# EAGLE design I2C (EAGLE 6.2)
I2C for PI GPIO Port (Pi4IoT)
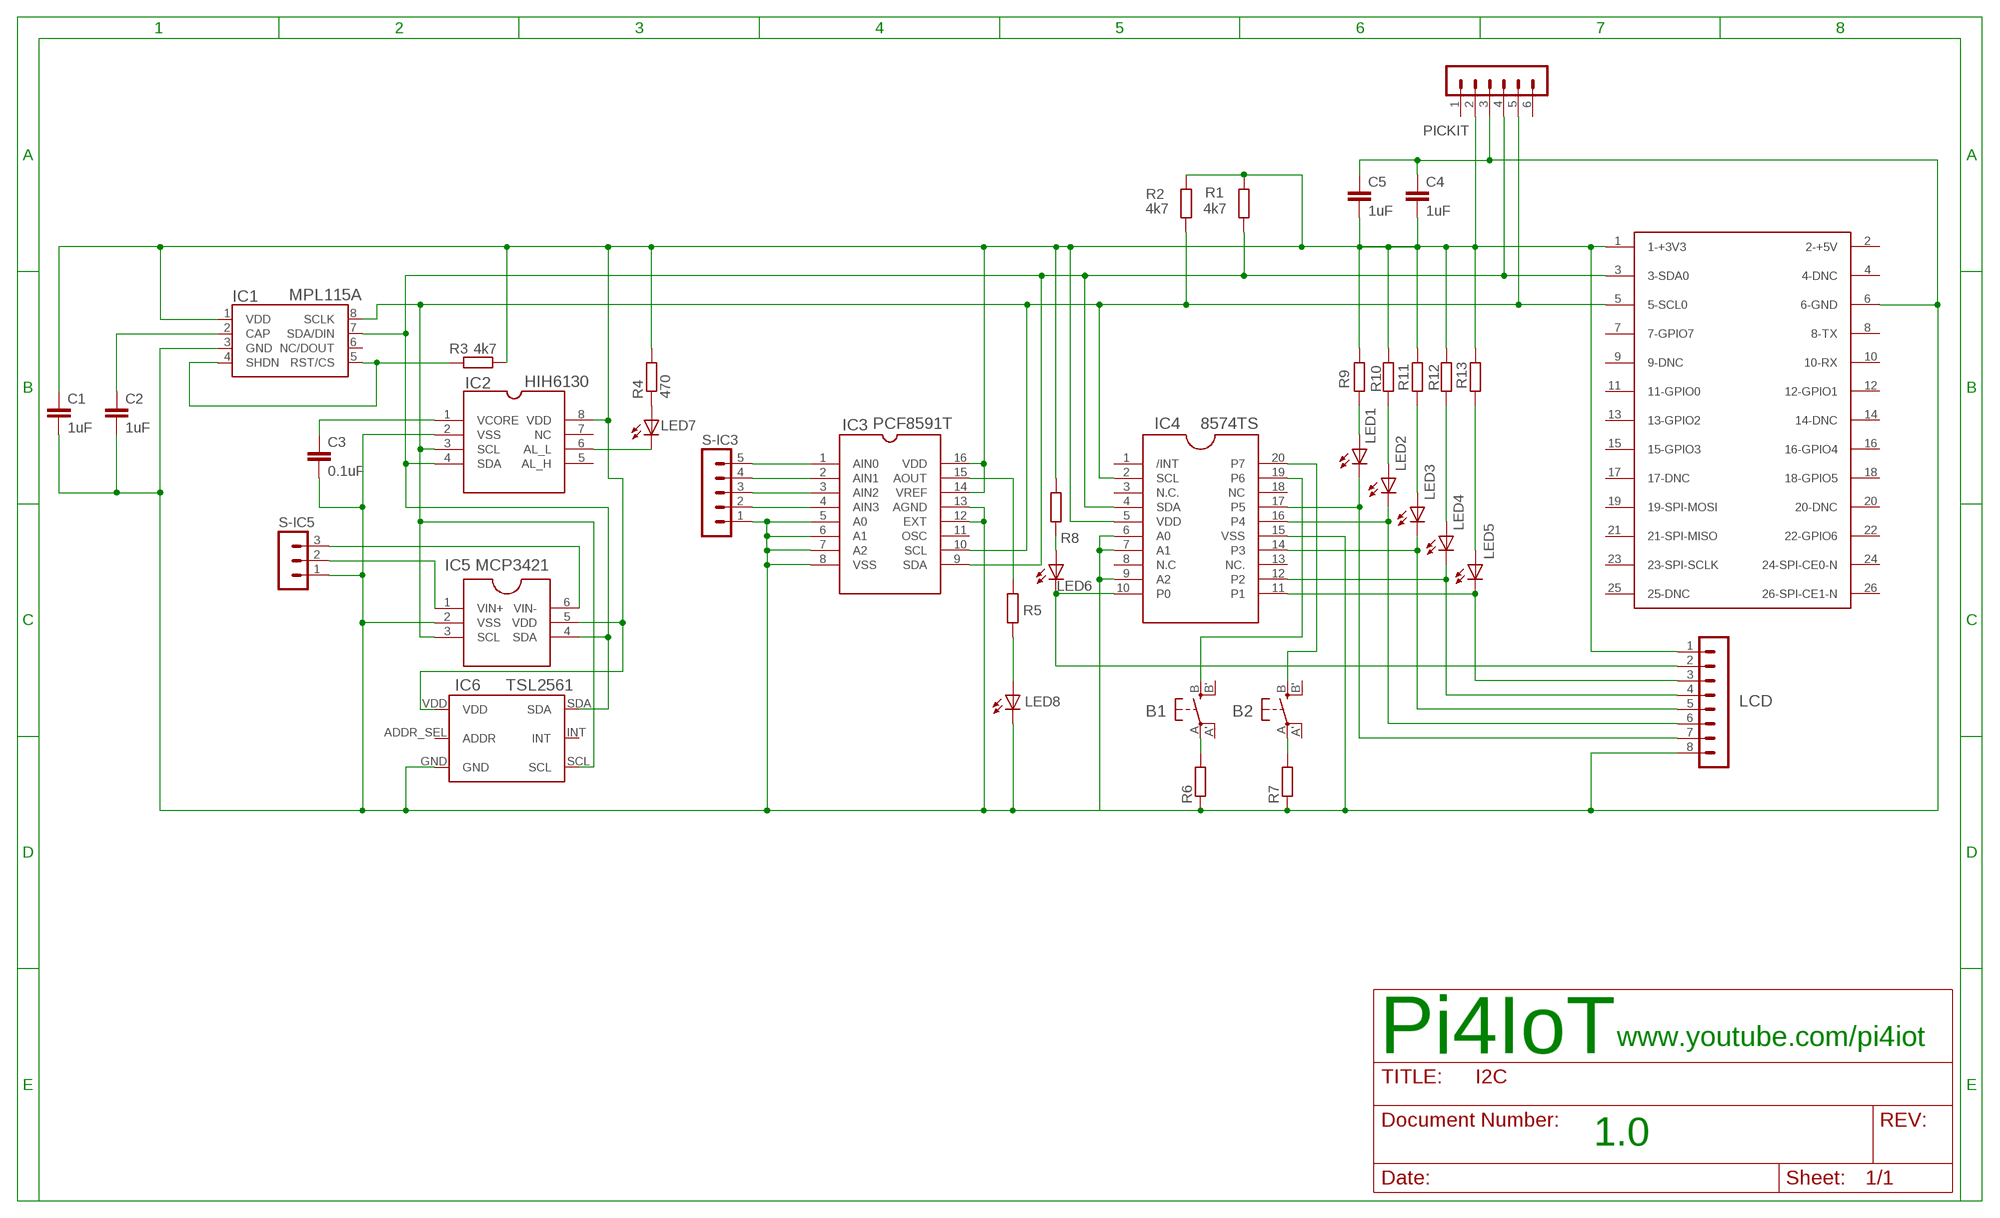
[diagram p0: schematic, sheet 1]

## Parts
B1  SWITCH_TACT_SMT  [EVQ-Q2]
B2  SWITCH_TACT_SMT  [EVQ-Q2]
C1  1uF  C-EUC1206  [C1206]
C2  1uF  C-EUC1206  [C1206]
C3  0.1uF  C-EUC1206  [C1206]
C4  1uF  C-EUC1206  [C1206]
C5  1uF  C-EUC1206  [C1206]
IC1  MPL115A  [LGA8]
IC2  HIH6130  [SO08]
IC3  PCF8591T  [SO-16W]
IC4  8574TS  [SSOP20]
IC5  MCP3421  MCP3421A0T  [SOT23-6]
IC6  TSL2561  TSL2561T  [TSL2561T]
LCD  MA08-1  [MA08-1]
LED1  LEDSML0603  [SML0603]
LED2  LEDSML0603  [SML0603]
LED3  LEDSML0603  [SML0603]
LED4  LEDSML0603  [SML0603]
LED5  LEDSML0603  [SML0603]
LED6  LEDSML0603  [SML0603]
LED7  LEDSML0603  [SML0603]
LED8  LEDSML0603  [SML0603]
PI  RASPBERRY-PI  [RASPBERRY-PI]
PICKIT  MA06-1  [MA06-1]
R1  4k7  R-EU_R0603  [R0603]
R2  4k7  R-EU_R0603  [R0603]
R3  4k7  R-EU_R0603  [R0603]
R4  470  R-EU_R0603  [R0603]
R5  R-EU_R0603  [R0603]
R6  R-EU_R0603  [R0603]
R7  R-EU_R0603  [R0603]
R8  R-EU_R0603  [R0603]
R9  R-EU_R0603  [R0603]
R10  R-EU_R0603  [R0603]
R11  R-EU_R0603  [R0603]
R12  R-EU_R0603  [R0603]
R13  R-EU_R0603  [R0603]
S-IC3  MA05-1  [MA05-1]
S-IC5  MA03-1  [MA03-1]

## Nets
GND: C1.2 C2.2 C3.2 C4.1 C5.1 IC1.3(GND) IC2.2(VSS) IC3.5(A0) IC3.6(A1) IC3.7(A2) IC3.8(VSS) IC3.12(EXT) IC3.13(AGND) IC4.6(A0) IC4.7(A1) IC4.9(A2) IC4.15(VSS) IC5.2(VSS) IC6.GND LCD.8 LED8.C PI.6(6-GND) PICKIT.3 R6.1 R7.1 S-IC3.1 S-IC5.1
L1/4: IC4.16(P4) LCD.6 LED2.C
LED4-4: IC4.12(P2) LCD.4 LED4.C
N$2: C3.1 IC2.1(VCORE)
N$3: C1.1 C4.2 C5.2 IC1.1(VDD) IC2.8(VDD) IC3.14(VREF) IC3.16(VDD) IC4.5(VDD) IC5.5(VDD) IC6.VDD LCD.1 PI.1(1-+3V3) PICKIT.2 R1.2 R2.2 R3.1 R4.2 R8.2 R9.2 R10.2 R11.2 R12.2 R13.2
N$4: IC1.8(SCLK) IC2.3(SCL) IC3.10(SCL) IC4.2(SCL) IC5.3(SCL) IC6.SCL PI.5(5-SCL0) PICKIT.5 R2.1
N$5: C2.1 IC1.2(CAP)
N$6: IC1.7(SDA/DIN) IC2.4(SDA) IC3.9(SDA) IC4.4(SDA) IC5.4(SDA) IC6.SDA PI.3(3-SDA0) PICKIT.4 R1.1
N$7: IC1.4(SHDN) IC1.5(RST/CS) R3.2
N$8: IC2.6(AL_L) LED7.C
N$9: LED7.A R4.1
N$10: IC3.15(AOUT) R5.2
N$11: LED8.A R5.1
N$12: IC3.4(AIN3) S-IC3.2
N$13: IC3.3(AIN2) S-IC3.3
N$14: IC3.2(AIN1) S-IC3.4
N$15: IC3.1(AIN0) S-IC3.5
N$16: IC5.6(VIN-) S-IC5.3
N$17: IC4.10(P0) LCD.2 LED6.C
N$18: IC5.1(VIN+) S-IC5.2
N$19: LED1.A R9.1
N$20: LED2.A R10.1
N$21: LED3.A R11.1
N$22: LED4.A R12.1
N$23: LED5.A R13.1
N$24: IC4.11(P1) LCD.3 LED5.C
N$25: LED6.A R8.1
N$26: IC4.14(P3) LCD.5 LED3.C
N$27: B1.B(S) IC4.19(P6)
N$28: IC4.17(P5) LCD.7 LED1.C
N$29: B2.B(S) IC4.20(P7)
N$30: B1.A(P) R6.2
N$31: B2.A(P) R7.2
Unconnected: B1.A'(P1) B1.B'(S1) B2.A'(P1) B2.B'(S1) IC1.6(NC/DOUT) IC2.5(AL_H) IC2.7(NC) IC3.11(OSC) IC4.1(/INT) IC4.3(N.C.) IC4.8(N.C) IC4.13(NC.) IC4.18(NC) IC6.ADDR_SEL(ADDR) IC6.INT PI.2(2-+5V) PI.4(4-DNC) PI.7(7-GPIO7) PI.8(8-TX) PI.9(9-DNC) PI.10(10-RX) PI.11(11-GPIO0) PI.12(12-GPIO1) PI.13(13-GPIO2) PI.14(14-DNC) PI.15(15-GPIO3) PI.16(16-GPIO4) PI.17(17-DNC) PI.18(18-GPIO5) PI.19(19-SPI-MOSI) PI.20(20-DNC) PI.21(21-SPI-MISO) PI.22(22-GPIO6) PI.23(23-SPI-SCLK) PI.24(24-SPI-CE0-N) PI.25(25-DNC) PI.26(26-SPI-CE1-N) PICKIT.1 PICKIT.6

## Notes on the sheet
- Pi4IoT | www.youtube.com/pi4iot
- 1.0

## Library data of the parts
B1 B2 = microbuilder:SWITCH_TACT_SMT: SMT Tact Switches 6x6mm - Digikey: P12940SCT-ND KMR2 (4.6x2.8mm) - Digikey: 401-1426-1-ND EVQ-PQHB55 - Light Touch, 160GF (4.5x4.5mm) - Digikey: P8090SCT-ND
C1-C5 = resistor:C-EU: CAPACITOR, European symbol
IC1 = SparkFun-Sensors:MPL115A: MPL115A1 (SPI) and MPL115A2 (I2C) Miniature Digital Barometer 5.0x3.0x1.2mm LGA Package
IC2 = raspberry_I2C:HIH6130
IC3 = raspberry_I2C:PCF8591T
IC4 = raspberry_I2C:8574TS
IC5 = raspberry_I2C:MCP3421A0T
IC6 = atmospheric:TSL2561T
LCD = con-lstb:MA08-1: PIN HEADER; OC_FARNELL: unknown; OC_NEWARK: unknown
LED1-LED8 = led:LED: LED OSRAM: - CHIPLED LG R971, LG N971, LY N971, LG Q971, LY Q971, LO R971, LY R971 LH N974, LH R974 LS Q976, LO Q976, LY Q976 LO Q996 - Hyper CHIPLED LW Q18S LB Q993, LB Q99A, LB R99A - SideLED LS A670, LO A670, LY A670, LG A670, LP A670 LB A673, LV A673, LT A673, LW A673 LH A674 LY A675 LS A676, LA A676, LO A676, LY A676, LW A676 LS A679, LY A679, LG A679 - Hyper Micro SIDELED® LS Y876, LA Y876, LO Y876, LY Y876 LT Y87S - SmartLED LW L88C, LW L88S LB L89C, LB L89S, LG L890 LS L89K, LO L89K, LY L89K LS L896, LA L896, LO L896, LY L896 - TOPLED LS T670, LO T670, LY T670, LG T670, LP T670 LSG T670, LSP T670, LSY T670, LOP T670, LYG T670 LG T671, LOG T671, LSG T671 LB T673, LV T673, LT T673, LW T673 LH T674 LS T676, LA T676, LO T676, LY T676, LB T676, LH T676, LSB T676, LW T676 LB T67C, LV T67C, LT T67C, LS T67K, LO T67K, LY T67K, LW E67C LS E67B, LA E67B, LO E67B, LY E67B, LB E67C, LV E67C, LT E67C LW T67C LS T679, LY T679, LG T679 LS T770, LO T770, LY T770, LG T770, LP T770 LB T773, LV T773, LT T773, LW T773 LH T774 LS E675, LA E675, LY E675, LS T675 LS T776, LA T776, LO T776, LY T776, LB T776 LHGB T686 LT T68C, LB T68C - Hyper Mini TOPLED® LB M676 - Mini TOPLED Santana® LG M470 LS M47K, LO M47K, LY M47K Source: http://www.osram.convergy.de LUXEON: - LUMILED® LXK2-PW12-R00, LXK2-PW12-S00, LXK2-PW14-U00, LXK2-PW14-V00 LXK2-PM12-R00, LXK2-PM12-S00, LXK2-PM14-U00 LXK2-PE12-Q00, LXK2-PE12-R00, LXK2-PE12-S00, LXK2-PE14-T00, LXK2-PE14-U00 LXK2-PB12-K00, LXK2-PB12-L00, LXK2-PB12-M00, LXK2-PB14-N00, LXK2-PB14-P00, LXK2-PB14-Q00 LXK2-PR12-L00, LXK2-PR12-M00, LXK2-PR14-Q00, LXK2-PR14-R00 LXK2-PD12-Q00, LXK2-PD12-R00, LXK2-PD12-S00 LXK2-PH12-R00, LXK2-PH12-S00 LXK2-PL12-P00, LXK2-PL12-Q00, LXK2-PL12-R00 Source: www.luxeon.com KINGBRIGHT: KA-3528ASYC Source: www.kingbright.com
PI = RaspberryPi:RASPBERRY-PI: Raspberry Pi Board <http://www.raspberrypi.org/> Jacques Lagnel V1.0 (beta) 2012 Board dimension: Forum 3D model <http://www.raspberrypi.org/forum/general-discussion/mechanical-profile-3d-models?value=3d%20model&type=1&include=1&search=1&ret=all> The GPIO Connector (P1): http://elinux.org/RPi_Low-level_peripherals
PICKIT = con-lstb:MA06-1: PIN HEADER; OC_FARNELL: unknown; OC_NEWARK: unknown
R1-R13 = resistor:R-EU_: RESISTOR, European symbol
S-IC3 = con-lstb:MA05-1: PIN HEADER; OC_FARNELL: unknown; OC_NEWARK: unknown
S-IC5 = con-lstb:MA03-1: PIN HEADER; OC_FARNELL: unknown; OC_NEWARK: unknown

## Board
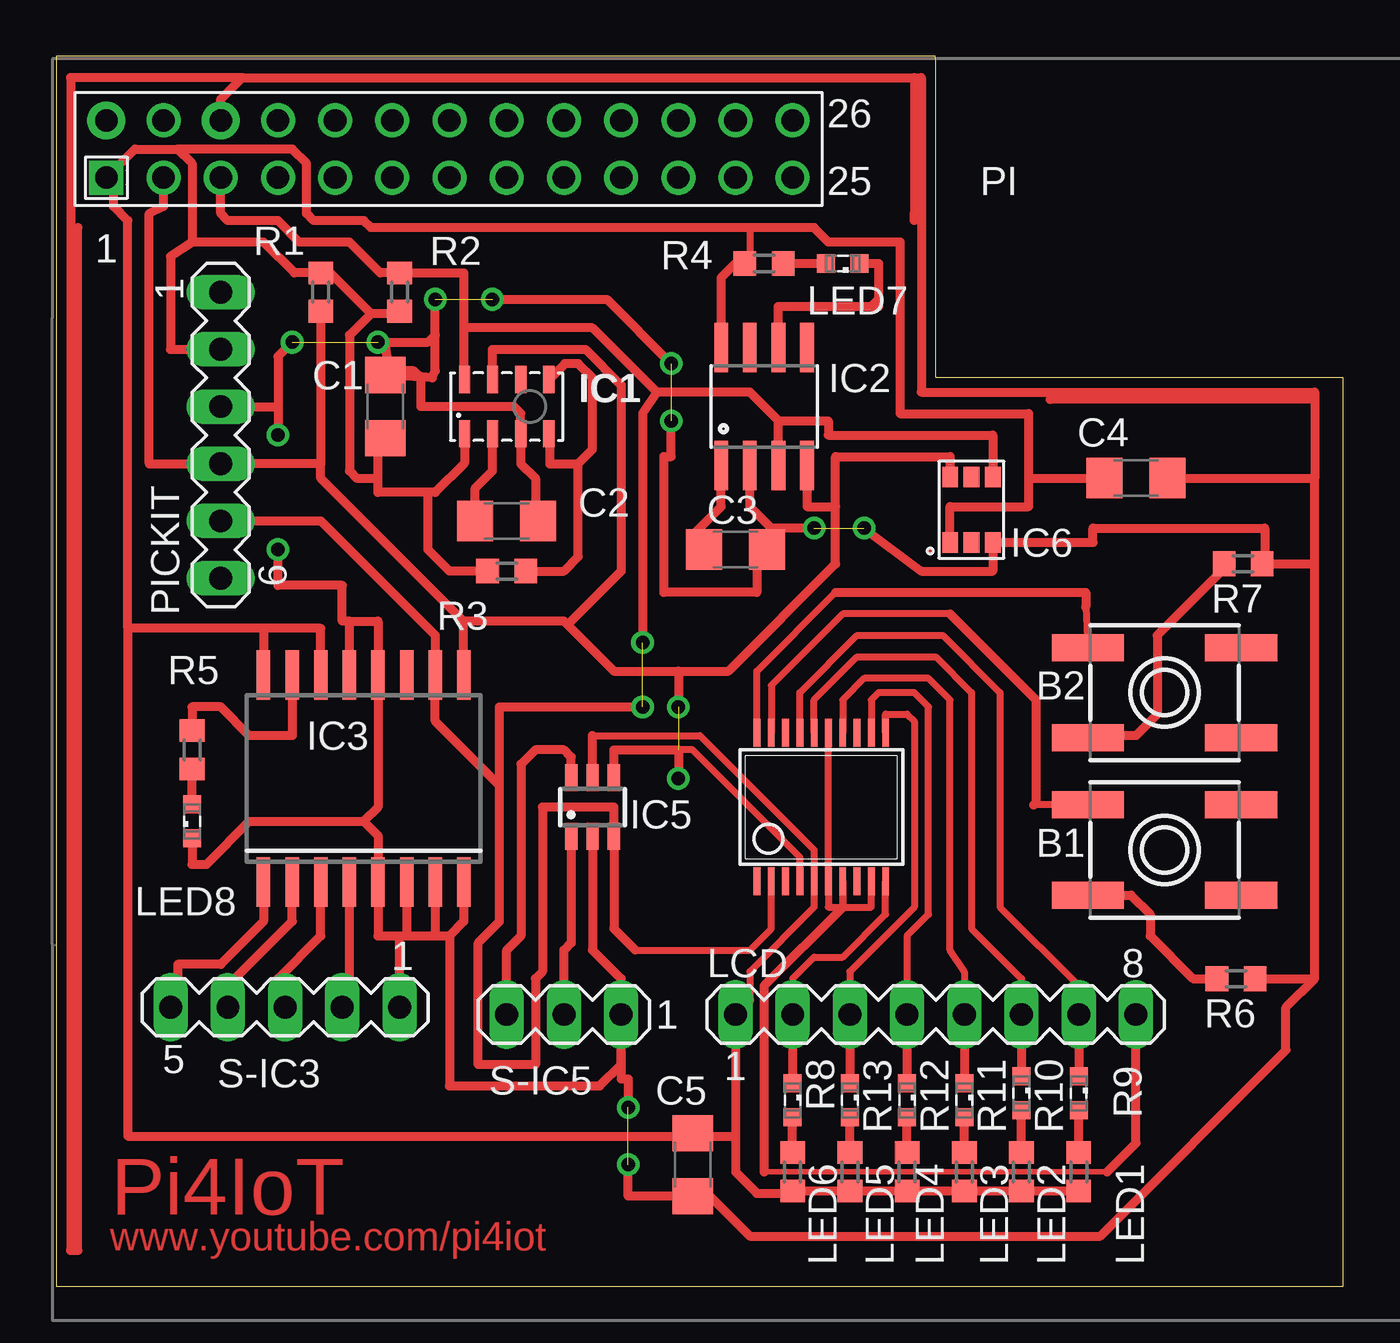
[diagram p1: board, top side]

Size 57.15 x 54.6 mm. Coordinates in mm from the lower left corner, seen from the top.
Outline: 0,0 57.15,0 57.15,40.32 39.05,40.32 39.05,54.29 39.04,54.6 0,54.6 0,0
Copper layers (1*16): Top 0.035mm / dielectric 1.5mm / Bottom 0.035mm
Design rules: minimum track width 10mil, minimum drill 24mil, track to track 8mil, track to pad 8mil, pad to pad 8mil, via to via 8mil, smd to smd 8mil, copper to edge 40mil, drill to drill 8mil, minimum pad ring 10mil, minimum via ring 8mil, stop-mask expansion 4mil, vias tented up to drill 0mil, thermal gap 10mil

### Footprints (pad centres in the part's own frame; a part is rotated, then mirrored left to right if it is on the bottom)
EVQ-Q2 = smd 3.2 x 1.2: A -3.4,-2; A' 3.4,-2; B -3.4,2; B' 3.4,2
C1206 = smd 1.6 x 1.8: 1 -1.4,0; 2 1.4,0
LGA8 = smd 1.2 x 0.5: 1 -1.2,1.875; 2 -1.2,0.625; 3 -1.2,-0.625; 4 -1.2,-1.875; 5 1.2,-1.875; 6 1.2,-0.625; 7 1.2,0.625; 8 1.2,1.875
SO08 = smd 0.61 x 2.21: 1 -1.905,-2.616; 2 -0.635,-2.616; 3 0.635,-2.616; 4 1.905,-2.616; 5 1.905,2.616; 6 0.635,2.616; 7 -0.635,2.616; 8 -1.905,2.616
SO-16W = smd 0.6 x 2.2: 1 -4.445,-4.6; 2 -3.175,-4.6; 3 -1.905,-4.6; 4 -0.635,-4.6; 5 0.635,-4.6; 6 1.905,-4.6; 7 3.175,-4.6; 8 4.445,-4.6; 9 4.445,4.6; 10 3.175,4.6; 11 1.905,4.6; 12 0.635,4.6; 13 -0.635,4.6; 14 -1.905,4.6; 15 -3.175,4.6; 16 -4.445,4.6
SSOP20 = smd 0.305 x 1.245: 1 -2.857,-3.302; 2 -2.222,-3.302; 3 -1.587,-3.302; 4 -0.952,-3.302; 5 -0.317,-3.302; 6 0.318,-3.302; 7 0.953,-3.302; 8 1.588,-3.302; 9 2.223,-3.302; 10 2.858,-3.302; 11 2.858,3.302; 12 2.223,3.302; 13 1.588,3.302; 14 0.953,3.302; 15 0.318,3.302; 16 -0.317,3.302; 17 -0.952,3.302; 18 -1.587,3.302; 19 -2.222,3.302; 20 -2.857,3.302
SOT23-6 = smd 0.55 x 1.2: 1 -0.95,-1.3; 2 0,-1.3; 3 0.95,-1.3; 4 0.95,1.3; 5 0,1.3; 6 -0.95,1.3
TSL2561T = smd 0.9 x 0.7: ADDR_SEL 0,0.95; GND 0,0; INT 2.9,0.95; SCL 2.9,0; SDA 2.9,1.9; VDD 0,1.9
MA08-1 = drill 1.016 long: 1 -8.89,0; 2 -6.35,0; 3 -3.81,0; 4 -1.27,0; 5 1.27,0; 6 3.81,0; 7 6.35,0; 8 8.89,0
SML0603 = smd 0.8 x 0.8: A 0.75,0; C -0.75,0
RASPBERRY-PI = drill 1 square: 1 0,0 | drill 1 pad 1.676: 2 0,2.54; 6 5.08,2.54 | drill 1: 3 2.54,0; 4 2.54,2.54; 5 5.08,0; 7 7.62,0; 8 7.62,2.54; 9 10.16,0; 10 10.16,2.54; 11 12.7,0; 12 12.7,2.54; 13 15.24,0; 14 15.24,2.54; 15 17.78,0; 16 17.78,2.54; 17 20.32,0; 18 20.32,2.54; 19 22.86,0; 20 22.86,2.54; 21 25.4,0; 22 25.4,2.54; 23 27.94,0; 24 27.94,2.54; 25 30.48,0; 26 30.48,2.54
MA06-1 = drill 1.016 long: 1 -6.35,0; 2 -3.81,0; 3 -1.27,0; 4 1.27,0; 5 3.81,0; 6 6.35,0
R0603 = smd 1 x 1.1: 1 -0.85,0; 2 0.85,0
MA05-1 = drill 1.016 long: 1 -5.08,0; 2 -2.54,0; 3 0,0; 4 2.54,0; 5 5.08,0
MA03-1 = drill 1.016 long: 1 -2.54,0; 2 0,0; 3 2.54,0

### Placement (x,y rotation side)
B1  49.21,19.37 0 top
B2  49.21,26.35 0 top
C1  14.6,39.05 90 top
C2  20,33.97 0 top
C3  30.16,32.7 0 top
C4  47.94,35.88 180 top
C5  28.26,5.4 90 top
IC1  20,39.05 90 top
IC2  31.43,39.05 0 top
IC3  13.65,22.54 0 top
IC4  33.97,21.27 0 top
IC5  23.81,21.27 0 top
IC6  41.59,33.02 90 top
LCD  39.05,12.07 0 top
LED1  45.4,8.57 270 top
LED2  42.86,8.57 270 top
LED3  40.32,8.25 270 top
LED4  37.78,8.25 270 top
LED5  35.24,8.25 270 top
LED6  32.7,8.25 270 top
LED7  34.92,45.4 180 top
LED8  6.03,20.64 90 top
PI  2.22,49.21 0 top
PICKIT  7.3,37.78 270 top
R1  11.75,44.13 90 top
R2  15.24,44.13 270 top
R3  20,31.75 0 top
R4  31.43,45.4 180 top
R5  6.03,23.81 90 top
R6  52.39,13.65 180 top
R7  52.7,32.07 180 top
R8  32.7,5.08 270 top
R9  45.4,5.08 270 top
R10  42.86,5.08 270 top
R11  40.32,5.08 270 top
R12  37.78,5.08 270 top
R13  35.24,5.08 270 top
S-IC3  10.16,12.38 180 top
S-IC5  22.54,12.07 180 top

### Tracks (layer width: path | path; a pad name or v marks a point on that pad's centre or on a via)
GND  (via drill 0.6)  (5 unrouted)
  Top 0.254: 31.43,5.08 46.67,5.08
  Top 0.305: 34.92,16.83 34.29,16.83 IC4.6 IC4.15 | 34.92,16.83 IC4.7 34.93,16.83 34.92,16.83 | 34.92,16.83 36.2,16.83 IC4.9
  Top 0.406: LED8.C 6.03,18.73 6.67,18.73 8.57,20.64 13.65,20.64 | 13.65,20.64 14.29,20 IC3.5 14.29,15.56 15.24,15.56 | 15.24,15.56 15.56,15.56 | IC3.6 15.56,15.56 | 15.56,15.56 16.83,15.56 | IC3.7 16.83,15.56 | 16.83,15.56 17.46,15.56 | IC3.13 13.02,29.53 | 13.02,29.53 14.29,29.53 IC3.12 14.29,21.27 13.65,20.64 | 17.46,15.56 17.46,8.89 24.13,8.89 25.08,9.84 S-IC5.1 | IC5.2 23.81,14.92 25.08,13.65 S-IC5.1 | C2.2 21.27,34.1 21.27,35.88 20.63,36.52 IC1.3 20.63,38.74 20.32,39.05 16.19,39.05 16.19,40.32 15.88,40.64 14.79,40.64 C1.2 16.7,40.32 | 31.69,33.35 C3.2 31.11,32.7 31.11,30.8 26.99,30.8 26.99,36.83 27.31,36.83 27.31,38.42 | 31.69,33.35 31.75,33.66 | 31.75,33.66 30.8,34.61 IC2.2 | S-IC3.1 15.24,15.56 | IC3.8 18.1,16.19 17.46,15.56 | 55.88,32.07 55.88,35.88 | 34.92,16.83 31.43,13.34 31.43,5.08 | 46.67,5.08 47.94,6.35 LCD.8 | PI.6 7.3,52.71 8.26,53.66 | 8.26,53.66 38.1,53.66 | 38.1,53.66 38.42,53.66 38.42,47.94 | PICKIT.3 9.84,39.05 | 9.84,39.05 9.84,37.78 | 13.02,29.53 12.7,29.53 12.7,31.12 9.84,31.12 9.84,32.7 | 16.7,40.32 16.83,40.64 16.83,42.23 | 16.83,42.23 16.83,43.81 | S-IC5.1 25.08,9.21 25.4,9.21 25.4,7.94 | 25.4,5.4 25.4,4 C5.1 29.02,4 30.8,2.22 46.35,2.22 54.61,10.48 54.61,12.38 55.88,13.65 | v19.37,43.81 24.45,43.81 v27.31,40.96 | 31.75,33.66 31.68,33.66 31.69,33.35 | v33.66,33.66 31.75,33.66 | 35.88,33.97 v35.88,33.66 38.42,31.75 41.59,31.75 IC6.GND 46.04,33.02 46.04,33.66 53.66,33.66 53.66,32.17 R7.1 55.88,32.07 | v10.48,41.91 9.84,41.27 9.84,39.05 | v14.29,41.91 14.6,41.91 | 14.6,41.91 16.51,41.91 16.83,42.23 | 16.7,40.32 14.79,40.51 14.6,41.91 | R6.1 55.88,13.65 | 55.88,13.65 55.88,32.07 | 38.42,47.94 38.42,39.69 55.88,39.69 55.88,39.37
  Top 0.406: 55.88,39.37 55.88,35.88 | C4.1 55.88,35.88 | 55.88,39.37 44.13,39.37 | 8.26,53.66 0.64,53.66 0.64,1.59 0.95,1.59 0.95,46.99 | 38.1,53.66 38.1,47.63 | 38.1,47.31 38.1,47.63 | 38.1,47.63 38.42,47.94
L1/4
  Top 0.305: IC4.16 33.66,26.04 35.56,27.94 39.05,27.94 40.64,26.35 40.64,15.87 42.86,13.65 LCD.6
  Top 0.406: LCD.6 LED2.C
LED4-4
  Top 0.305: IC4.12 36.2,26.04 36.51,26.35 38.1,26.35 38.74,25.72 38.74,16.51 37.78,15.56 LCD.4
  Top 0.406: LCD.4 LED4.C
N$1  (via drill 0.6)
  other vias: 27.62,25.72
N$2
  Top 0.406: C3.1 28.26,32.7 28.26,33.34 29.53,34.61 IC2.1
N$3
  Top 0.305: 30.8,12.7 30.8,13.97 33.66,16.83 IC4.5 33.66,19.37 28.58,24.45 23.81,24.45 | 32.6,4.13 R8.2 | 30.8,46.99 30.8,45.62 R4.2
  Top 0.406: IC1.1 18.13,36.54 16.83,35.24 16.51,35.24 | 16.51,35.24 14.29,35.24 14.29,35.88 | R8.2 R13.2 R12.2 R11.2 R10.2 R9.2 | 30.16,6.67 LCD.1 30.8,12.7 | 30.16,6.67 30.16,5.08 31.11,4.13 32.6,4.13 | R3.1 17.46,31.75 16.51,32.7 16.51,35.24 | R4.2 30.16,45.4 29.53,44.77 IC2.8 | 13.97,43.18 12.17,44.98 R1.2 10.58,44.98 9.21,46.35 6.03,46.35 | R2.2 15.14,43.18 13.97,43.18 | IC3.14 11.75,29.21 9.21,29.21 | 9.21,29.21 IC3.16 | 5.4,50.48 3.49,50.48 PI.1 2.54,48.9 2.54,47.94 3.17,47.31 3.17,29.21 | 5.4,50.48 6.03,49.85 6.03,46.35 | 6.03,46.35 5.08,45.72 5.08,41.59 PICKIT.2 | 14.29,35.88 14.29,37.34 C1.1 | 13.97,43.18 13.02,42.23 13.02,36.19 13.33,35.88 14.29,35.88 | 9.21,29.21 3.17,29.21 | 5.4,50.48 10.48,50.48 11.11,49.85 11.11,47.63 11.43,47.31 13.65,47.31 13.97,46.99 30.8,46.99 33.66,46.99 34.29,46.35 37.46,46.35 37.46,38.73 43.18,38.73 43.18,35.88 | IC5.5 23.81,24.45 | 3.17,29.21 3.17,6.67 27.62,6.67 | 27.62,6.67 30.16,6.67 | C5.2 27.75,6.8 27.62,6.67 | 43.18,35.88 C4.2 | 43.18,35.88 43.18,34.61 39.69,34.61 39.69,33.34 IC6.VDD
N$4  (via drill 0.6)  (1 unrouted)
  Top 0.305: 25.72,14.92 30.8,14.92 31.75,15.87 IC4.2
  Top 0.406: 25.72,14.92 24.76,15.88 IC5.3 24.76,21.27 21.59,21.27 21.59,13.97 21.27,13.65 21.27,9.84 18.73,9.84 18.73,15.24 19.69,16.19 19.69,22.23 | IC2.3 32.07,38.42 | 32.07,38.42 30.8,39.69 26.67,39.69 | 26.67,39.69 23.81,42.55 18.1,42.55 | 18.1,42.55 18.1,40.32 | 18.1,40.32 18.1,40.28 IC1.8 18.13,40.29 18.1,40.32 | 18.1,42.55 18.1,44.98 R2.1 14.39,44.98 13.02,46.35 10.79,46.35 9.84,47.31 7.62,47.31 7.3,47.63 PI.5 | PICKIT.5 11.75,33.97 16.83,28.89 IC3.10 16.83,25.08 19.69,22.23 | 19.69,22.23 19.69,25.72 v26.03,25.72 | 26.67,39.69 26.03,38.73 v26.03,28.58 | 32.07,38.42 34.29,38.42 34.29,37.78 41.59,37.78 IC6.SCL
N$5
  Top 0.406: C2.1 18.6,35.43 19.37,36.19 IC1.2
N$6  (via drill 0.6)  (1 unrouted)
  Top 0.305: IC4.4 33.02,19.05 28.26,23.81 27.62,23.81
  Top 0.406: IC3.9 18.1,29.53 | 18.1,29.53 11.75,35.88 11.75,36.51 | 11.75,36.51 PICKIT.4 4.13,36.51 4.13,47.63 4.76,47.94 PI.3 | IC5.4 24.76,23.81 27.62,23.81 v27.62,22.54 | 22.7,29.37 24.76,27.31 27.62,27.31 | 22.7,29.37 22.54,29.53 18.1,29.53 | IC2.4 33.34,34.61 34.61,34.61 | 27.62,27.31 29.85,27.31 34.61,32.07 34.61,34.61 | R1.1 11.75,36.51 | IC1.7 19.38,41.58 19.37,41.59 23.49,41.59 25.08,40.01 25.08,31.75 22.7,29.37 | 27.62,27.31 27.62,25.72 | 34.61,34.61 34.61,36.83 39.69,36.83 39.69,36.24 IC6.SDA
N$7
  Top 0.406: IC1.4 21.88,37.81 21.91,37.78 21.91,36.51 23.18,36.51 | IC1.5 22.58,40.96 23.18,40.96 23.81,40.32 23.81,37.15 23.34,36.67 23.18,36.51 | R3.2 22.54,31.75 23.18,32.38 23.18,36.51
N$8
  Top 0.406: IC2.6 32.07,43.5 36.2,43.5 | 36.2,43.5 36.51,43.5 | LED7.C 36.51,45.4 36.51,43.81 36.2,43.5
N$9
  Top 0.406: R4.1 LED7.A
N$10
  Top 0.406: IC3.15 10.48,24.45 8.57,24.45 7.3,25.72 6.03,25.72 R5.2
N$11
  Top 0.406: LED8.A R5.1
N$12
  Top 0.406: IC3.4 13.02,12.7 S-IC3.2
N$13
  Top 0.406: IC3.3 11.75,15.56 9.84,13.65 9.84,12.7 S-IC3.3
N$14
  Top 0.406: IC3.2 10.48,16.19 7.62,13.34 S-IC3.4
N$15
  Top 0.406: IC3.1 9.21,16.19 7.3,14.29 5.4,14.29 5.4,12.7 S-IC3.5
N$16
  Top 0.406: IC5.6 22.86,23.49 22.54,23.81 21.27,23.81 20.64,23.18 20.64,15.56 20,14.92 S-IC5.3
N$17
  Top 0.305: IC4.10 36.83,16.51 34.92,14.6 33.66,14.6 32.7,13.65 LCD.2
  Top 0.406: LCD.2 LED6.C
N$18
  Top 0.406: IC5.1 22.86,15.24 22.54,14.92 S-IC5.2
N$19
  Top 0.406: R9.1 LED1.A
N$20
  Top 0.406: R10.1 LED2.A
N$21
  Top 0.406: R11.1 LED3.A
N$22
  Top 0.406: R12.1 LED4.A
N$23
  Top 0.406: R13.1 LED5.A
N$24
  Top 0.305: IC4.11 36.83,25.4 | 36.83,25.4 | 36.83,25.4 37.78,25.4 38.1,25.08 38.1,16.83 35.24,13.97 LCD.3
  Top 0.406: LCD.3 LED5.C
N$25
  Top 0.406: R8.1 LED6.A
N$26
  Top 0.305: IC4.14 34.92,26.04 35.88,26.99 38.74,26.99 39.69,26.04 39.69,14.92 40.32,13.97 LCD.5
  Top 0.406: LCD.5 LED3.C
N$27
  Top 0.305: B1.B 43.4,21.37 | 39.69,29.84 34.92,29.84 31.75,26.67 IC4.19
  Top 0.406: 39.69,29.84 43.5,26.04 43.5,21.46 43.4,21.37
N$28
  Top 0.305: IC4.17 33.02,26.35 35.56,28.89 39.37,28.89 41.91,26.35 41.91,16.83 45.4,13.34 LCD.7
  Top 0.406: LCD.7 LED1.C
N$29
  Top 0.305: IC4.20 31.12,27.3 31.11,27.3 34.61,30.8 | 45.72,30.16 B2.B
  Top 0.406: 34.61,30.8 45.72,30.8 45.72,30.16
N$30
  Top 0.406: B1.A 47.72,17.37 48.58,16.51 48.58,15.56 50.48,13.65 R6.2
N$31
  Top 0.406: R7.2 51.85,31.85 48.89,28.89 48.89,25.4 47.94,24.45 45.91,24.45 B2.A
N$32  (via drill 0.6)
  other vias: 16.83,43.81
N$35  (via drill 0.6)
  other vias: 27.3,38.42
N$36  (via drill 0.6)
  other vias: 9.84,37.78
N$37  (via drill 0.6)
  other vias: 9.84,32.7
N$40  (via drill 0.6)
  other vias: 25.4,7.94
N$41  (via drill 0.6)
  other vias: 25.4,5.4

### Text on the board
Top: Pi4IoT | www.youtube.com/pi4iot